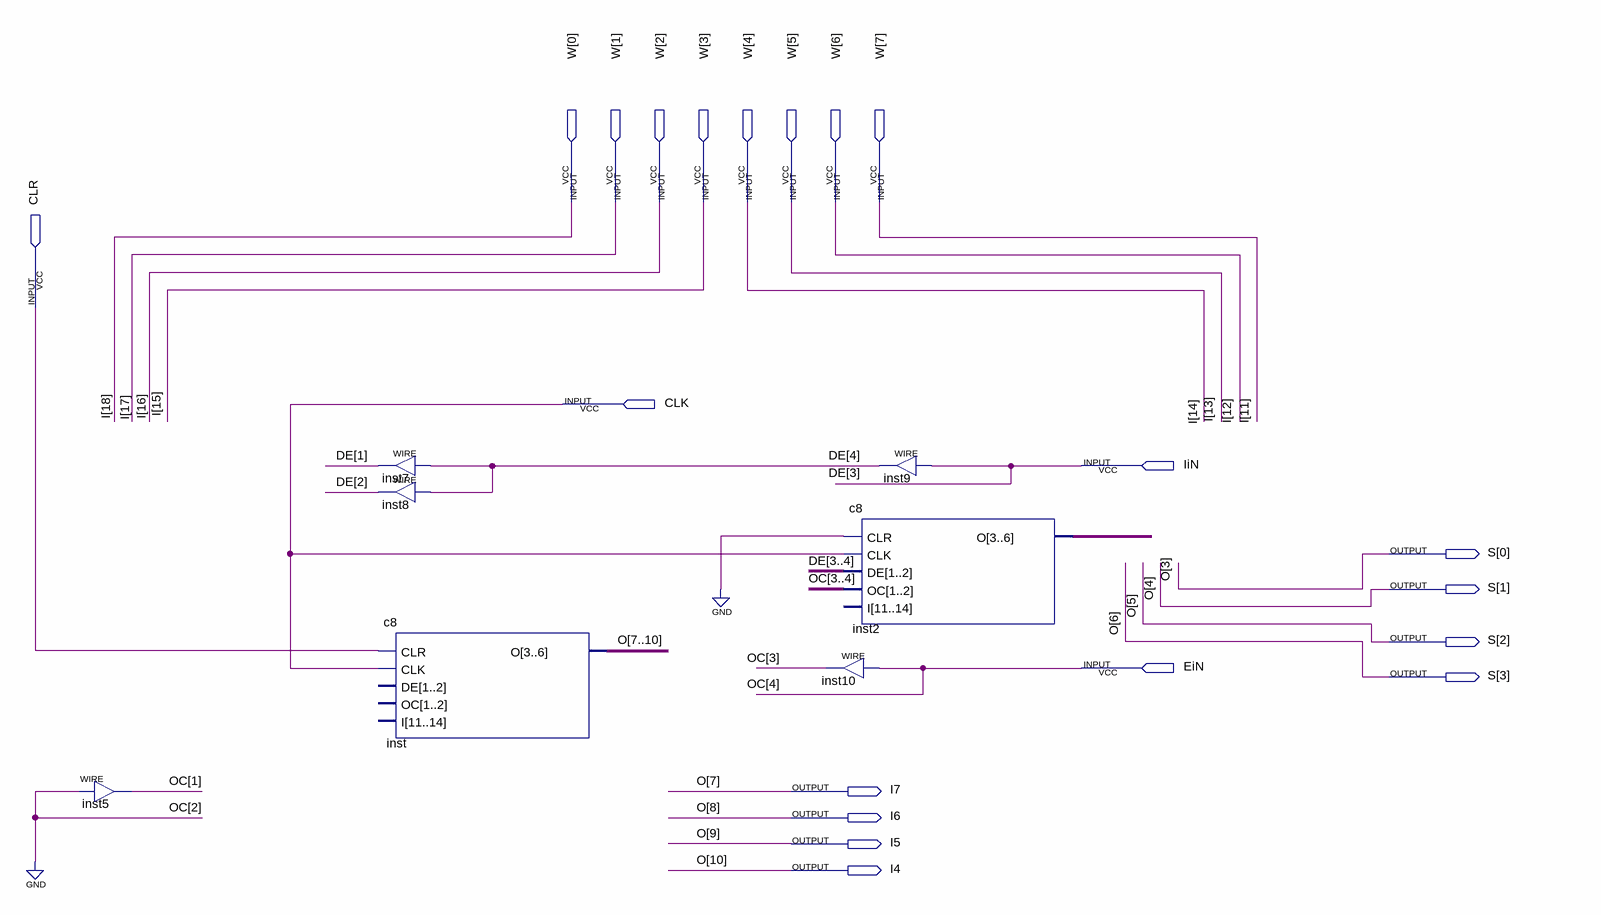
[diagram p0: schematic sheet]
// Quartus schematic iregister.bdf as structural Verilog: 7 symbols, 20 pins
module iregister (
  input  [7:0] W,
  input  CLR,
  input  CLK,
  input  IiN,
  input  EiN,
  output [3:0] S,
  output I7,
  output I6,
  output I5,
  output I4
);

  wire [3:0] inst2_o;
  wire [3:1] OC;
  wire [4:1] DE;

  assign OC[1] = 1'b0;  // WIRE inst5
  assign DE[1] = DE[4];  // WIRE inst7
  assign DE[2] = DE[4];  // WIRE inst8
  c8 inst (.CLR(CLR), .CLK(CLK), .O({I7, I6, I5, I4}));  // open: DE, OC, I
  c8 inst2 (.CLR(1'b0), .CLK(CLK), .DE({IiN, DE[4]}), .OC({OC[3], EiN}), .O(inst2_o));  // open: I
  assign OC[3] = EiN;  // WIRE inst10
  assign DE[4] = IiN;  // WIRE inst9

  // Other names for the same wires on the sheet: DE[3] = IiN; O[10:3] = {I4, I5, I6, I7, S}; OC[4] = EiN;
  //   I[18:11] = {W[0], W[1], W[2], W[3], W[4], W[5], W[6], W[7]}
endmodule
